# Altium schematic sheet Sheet2.SchDoc
size A; SheetNumber: 1; SheetTotal: 1
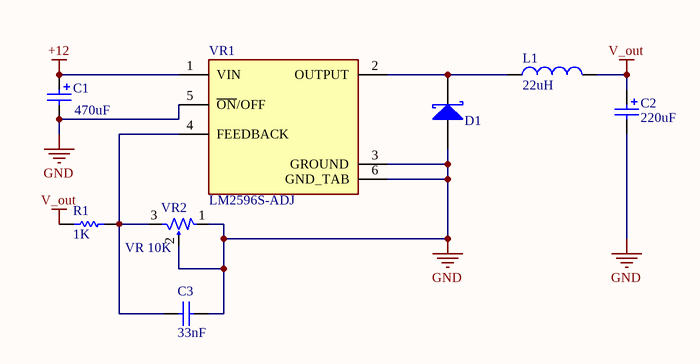
[diagram p0: Sheet2.SchDoc]

## Parts
C1  value 470uF  [CAP ALU SIZE B]  (hidden comment: Cap Pol SMD)
C2  value 220uF  [CAP ALU SIZE B]  (hidden comment: Cap Pol SMD)
C3  value 33nF  [CAP-SM-0805]  (hidden comment: Cap Non-Pol SMD)
D1  D Schottky  [SS34]  (value not drawn)
L1  value 22uH  [INDUCTOR 12.5x12.5]  (hidden comment: Inductor)
R1  value 1K  [RES-SM-0603]  (hidden comment: RESISTOR SMD)
VR1  LM2596S-ADJ  [TO170P1524X483-6N]
VR2  value VR 10K  [Varistor 1]  (hidden comment: 10K)

## Nets
+12: C1.1 VR1.1(VIN)
GND: C1.2 C2.2 C3.1 D1.1(A) VR1.3(GROUND) VR1.5(~{ON}/OFF) VR1.6(GND_TAB) VR2.1 VR2.2
V_out: C2.1 L1.2 R1.1
NetC3_2: C3.2 R1.2 VR1.4(FEEDBACK) VR2.3
NetD1_2: D1.2(K) L1.1 VR1.2(OUTPUT)

## Library data of the parts
C1 C2 = Cap Pol SMD: Polarized Capacitor (Radial)
C3 = Cap Non-Pol SMD: Capacitor
D1 = D Schottky: SS54-SMB; Published: 8-Jun-2000; LatestRevisionDate: 17-Jul-2002; LatestRevisionNote: Re-released for DXP Platform.; PackageReference: SMB; Publisher: Altium Limited; PackageDescription: DO-214-AA/SMB; 2 C-Bend Leads; Body 5.3 x 3.6 mm, inc. leads (LxW); Code_JEDEC: DO-214-AA
R1 = RESISTOR SMD: Resistor
VR1 = LM2596S-5.0: SIMPLE SWITCHER&reg; 4.5V to 40V, 3A Low Component Count Step-Down Regulator; MP: LM2596S-5.0/NOPB; MF: Texas Instruments; Price: None; Availability: In Stock; Package: TO-263-5 Texas Instruments; SnapEDA_Link: https://www.snapeda.com/parts/LM2596S-5.0/NOPB/Texas+Instruments/view-part/?ref=snap; Check_prices: https://www.snapeda.com/parts/LM2596S-5.0/NOPB/Texas+Instruments/view-part/?ref=eda; Value: *; Purchase-URL: https://pricing.snapeda.com/search/part/LM2596S-5.0/NOPB/?ref=eda
VR2 = Var Resistor